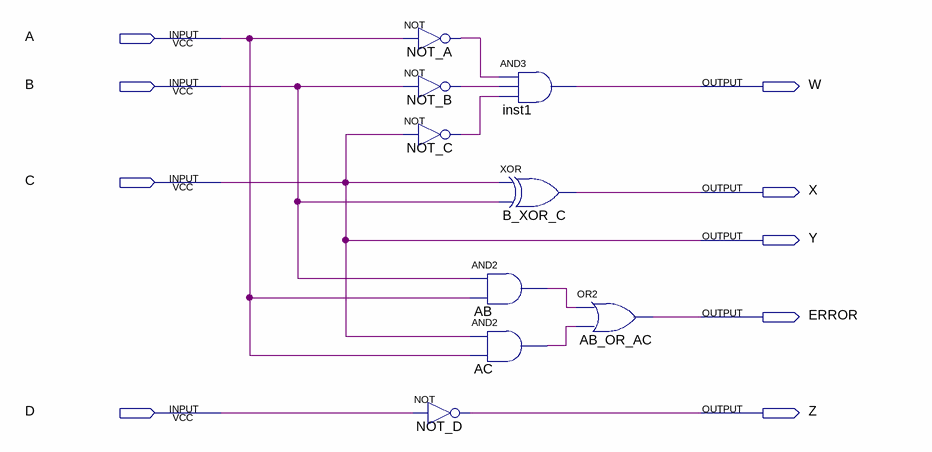
[diagram p0: schematic sheet]
// Quartus schematic Question2.bdf as structural Verilog: 9 symbols, 9 pins
module Question2 (
  input  A,
  input  B,
  input  C,
  input  D,
  output W,
  output X,
  output Y,
  output ERROR,
  output Z
);

  wire AB_out, AC_out, NOT_A_out, NOT_B_out, NOT_C_out;

  not NOT_A (NOT_A_out, A);
  not NOT_B (NOT_B_out, B);
  not NOT_C (NOT_C_out, C);
  not NOT_D (Z, D);
  and inst1 (W, NOT_A_out, NOT_B_out, NOT_C_out);
  xor B_XOR_C (X, C, B);
  and AB (AB_out, B, A);
  and AC (AC_out, C, A);
  or AB_OR_AC (ERROR, AB_out, AC_out);

  assign Y = C;
endmodule
